# EasyEDA schematic Trinket_EasyEDA.json
TITLE: Sheet_1; REV: 1.0; Date: 2022-07-22; Sheet: 1/1; Drawn By: malhaar.karandikar; Company: Your Company
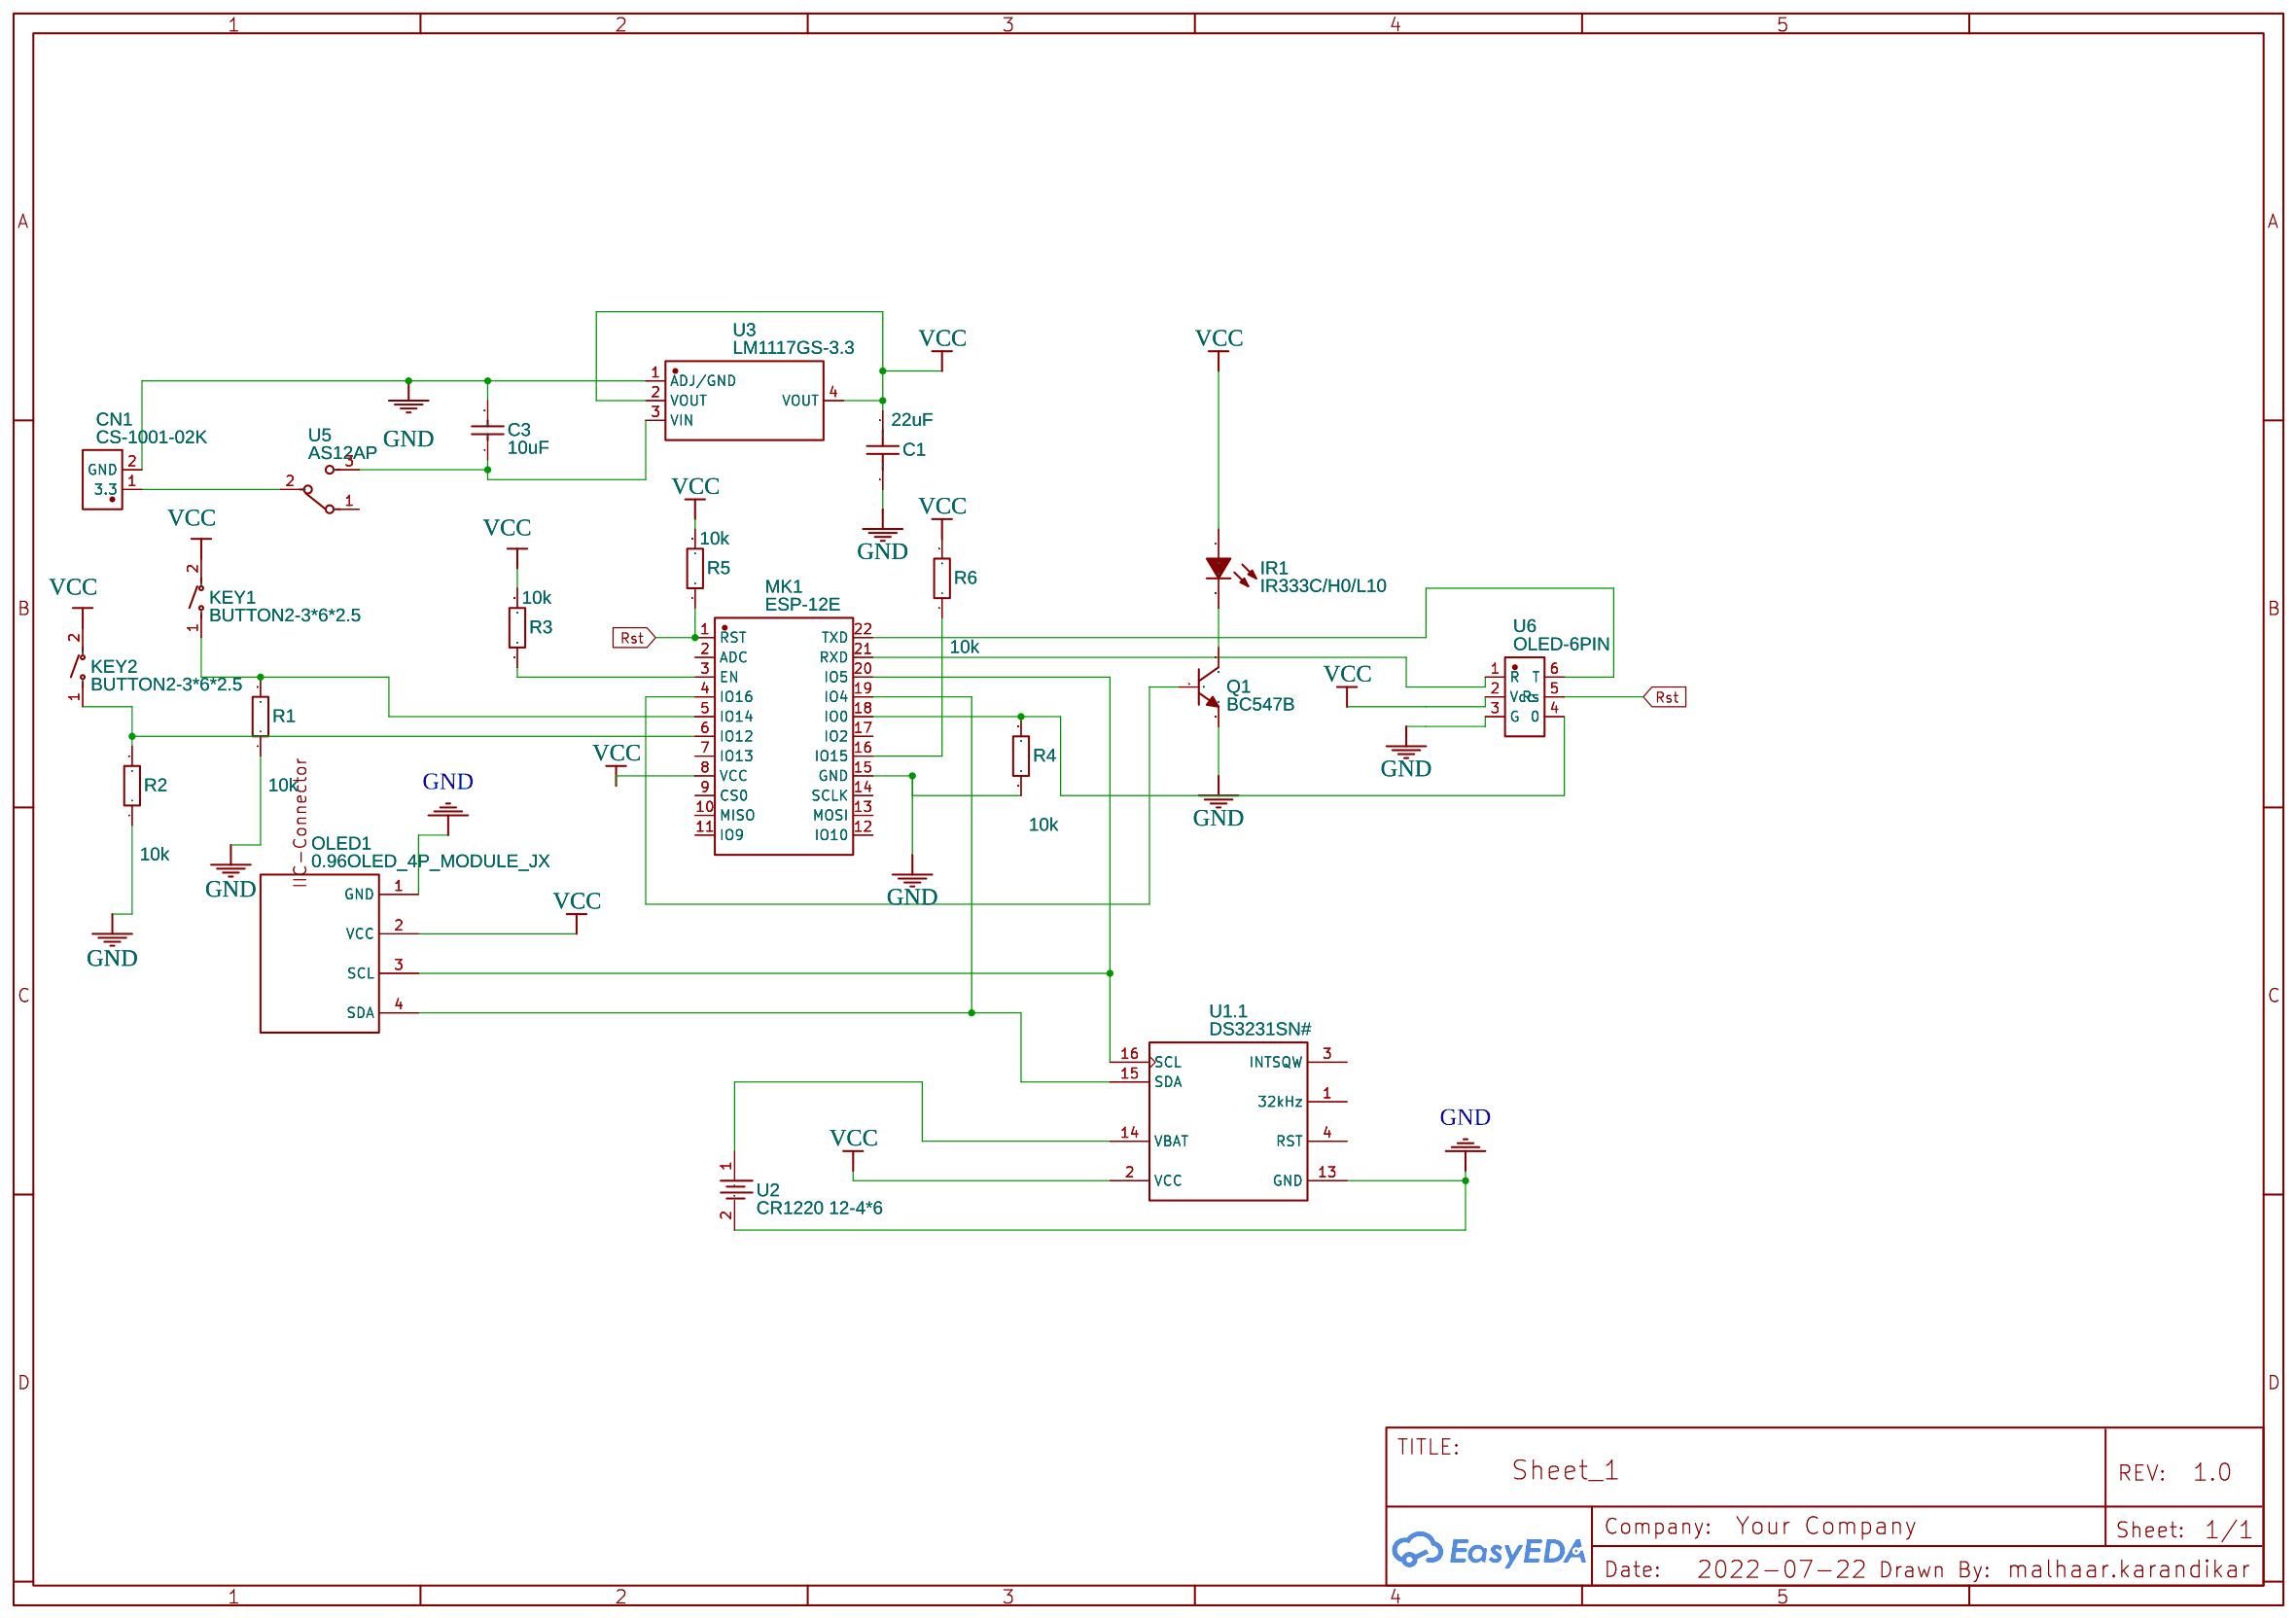
[diagram p0: schematic sheet]

## Parts
C1  22uF  [C0805]
C3  10uF  [C1206]
CN1  CS-1001-02K  [CONN-TH_2P-P2.50_CST_CS-1001-02K]
IR1  IR333C/H0/L10  [LED-TH_BD5.0-P2.54-FD]
KEY1  BUTTON2-3*6*2.5  [SW-SMD_L6.0-W3.7-LS8.0]
KEY2  BUTTON2-3*6*2.5  [SW-SMD_L6.0-W3.7-LS8.0]
MK1  ESP-12E  [WIFIM-SMD_ESP-12E-BR]
OLED1  0.96OLED_4P_MODULE_JX  [0.96OLED_4P]
Q1  BC547B  [TO-92-3_L4.9-W3.7-P1.27-L]
R1  10k  [R1206]
R2  10k  [R1206]
R3  10k  [R1206]
R4  10k  [R1206]
R5  10k  [R1206]
R6  10k  [R1206]
U1  DS3231SN#  [SOIC-16_L10.3-W7.5-P1.27-LS10.3-BL]  (section 1)
U2  CR1220 12-4*6  [BAT-TH_CR1220-12]
U3  LM1117GS-3.3  [SOT-223-3_L6.5-W3.4-P2.30-LS7.0-BR]
U5  AS12AP  [SW-TH_NKK_AS12AP]
U6  OLED-6PIN  [HDR-TH_6P-P2.54-V-F-2]

## Library data of the parts
C1 = CC0805KKX5R5BB226: Supplier: LCSC; Supplier Part: C326578; Manufacturer: YAGEO; Contributor: LCSC; JLCPCB Part Class: Extended Part
C3 = CC1206KKX5R8BB106: Supplier: LCSC; Manufacturer: YAGEO; Contributor: LCSC; Supplier Part: C128855; JLCPCB Part Class: Extended Part
CN1 = CS-1001-02K: Supplier: LCSC; Supplier Part: C2886647; Manufacturer: CST(永丰盈); Contributor: LCSC; JLCPCB Part Class: Extended Part
IR1 = IR333C/H0/L10: Supplier: LCSC; Manufacturer: EVERLIGHT; Supplier Part: C72053; JLCPCB Part Class: Extended Part
KEY1 KEY2 = BUTTON2-3*6*2.5: Supplier: LCSC; Supplier Part: C9900009018; Manufacturer: null; Contributor: LCSC; JLCPCB Part Class: Extended Part
MK1 = ESP-12E: Supplier: LCSC; Manufacturer: Ai-Thinker; Supplier Part: C89297; JLCPCB Part Class: Extended Part
OLED1 = 0.96OLED_4P_MODULE_JX: Supplier: LCSC; Supplier Part: C9900004566; Manufacturer: null; Contributor: LCSC; JLCPCB Part Class: Extended Part
Q1 = BC547B: Supplier: LCSC; Supplier Part: C713613; Manufacturer: LGE; Contributor: LCSC; JLCPCB Part Class: Extended Part
R1-R6 = AECR1206F2R00T9: Supplier: LCSC; Supplier Part: C352102; Manufacturer: ResistorToday; Resistance (Ohms): 2; Contributor: LCSC; JLCPCB Part Class: Extended Part
U1 = DS3231SN#: tags: Clock; Supplier Part: C9866; Supplier: LCSC; Manufacturer: MAXIM; Manufacturer Part: DS3231SN; subpart_no: 1; image: http://image.lceda.cn/szlcsc/C9866.jpg; JLCPCB Part Class: Extended Part
U2 = CR1220 12-4*6: Supplier: LCSC; Supplier Part: C70380; Manufacturer: Q&J; Contributor: LCSC; JLCPCB Part Class: Extended Part
U3 = LM1117GS-3.3: Supplier: LCSC; Supplier Part: C411821; Manufacturer: HTC Korea TAEJIN Tech; Contributor: LCSC; JLCPCB Part Class: Extended Part
U5 = AS12AP: Contributor: lcsc; Supplier: LCSC; Supplier Part: C5366625; Manufacturer: NKK Switches; JLCPCB Part Class: Extended Part; link: https://lcsc.com/eda_search?q=C5366625&%26type=1&ref=editor
U6 = OLED-6PIN: Contributor: lcsc; Supplier: LCSC; Supplier Part: C9900007737; Manufacturer: null; JLCPCB Part Class: Extended Part; link: https://lcsc.com/eda_search?q=C9900007737&%26type=1&ref=editor

## Nets
GND: C1.1 C3.2 CN1.2(GND) MK1.15(GND) OLED1.1(GND) Q1.3(E) R1.1 R2.1 R4.1 U1.13(GND) U2.2 U3.1(ADJ/GND) U6.3(G)
VCC: C1.2 IR1.1(A) KEY1.2 KEY2.2 MK1.8(VCC) OLED1.2(VCC) R3.2 R5.2 R6.2 U1.2(VCC) U3.2(VOUT) U3.4(VOUT) U6.2(Vcc)
Rst: MK1.1(RST) R5.1 U6.5(Rs)
Net-(C3-1): C3.1 U3.3(VIN) U5.3
Net-(CN1-1): CN1.1(3.3) U5.2
Net-(IR1-2): IR1.2(C) Q1.1(C)
Net-(KEY1-1): KEY1.1 MK1.5(IO14) R1.2
Net-(KEY2-1): KEY2.1 MK1.6(IO12) R2.2
Net-(MK1-3): MK1.3(EN) R3.1
Net-(MK1-4): MK1.4(IO16) Q1.2(B)
Net-(MK1-16): MK1.16(IO15) R6.1
Net-(MK1-18): MK1.18(IO0) R4.2 U6.4(0)
Net-(MK1-19): MK1.19(IO4) OLED1.4(SDA) U1.15(SDA)
Net-(MK1-20): MK1.20(IO5) OLED1.3(SCL) U1.16(SCL)
Net-(MK1-21): MK1.21(RXD) U6.1(R)
Net-(MK1-22): MK1.22(TXD) U6.6(T)
Net-(U1.1-14): U1.14(VBAT) U2.1

Not connected (* = marked no-connect by the designer): MK1 2(ADC) 7(IO13) 9(CS0) 10(MISO) 11(IO9) 12(IO10) 13(MOSI) 14(SCLK) 17(IO2); U1 1(32kHz) 3(INTSQW) 4(RST); U5 1
